# Altium project 报告.PrjPCB
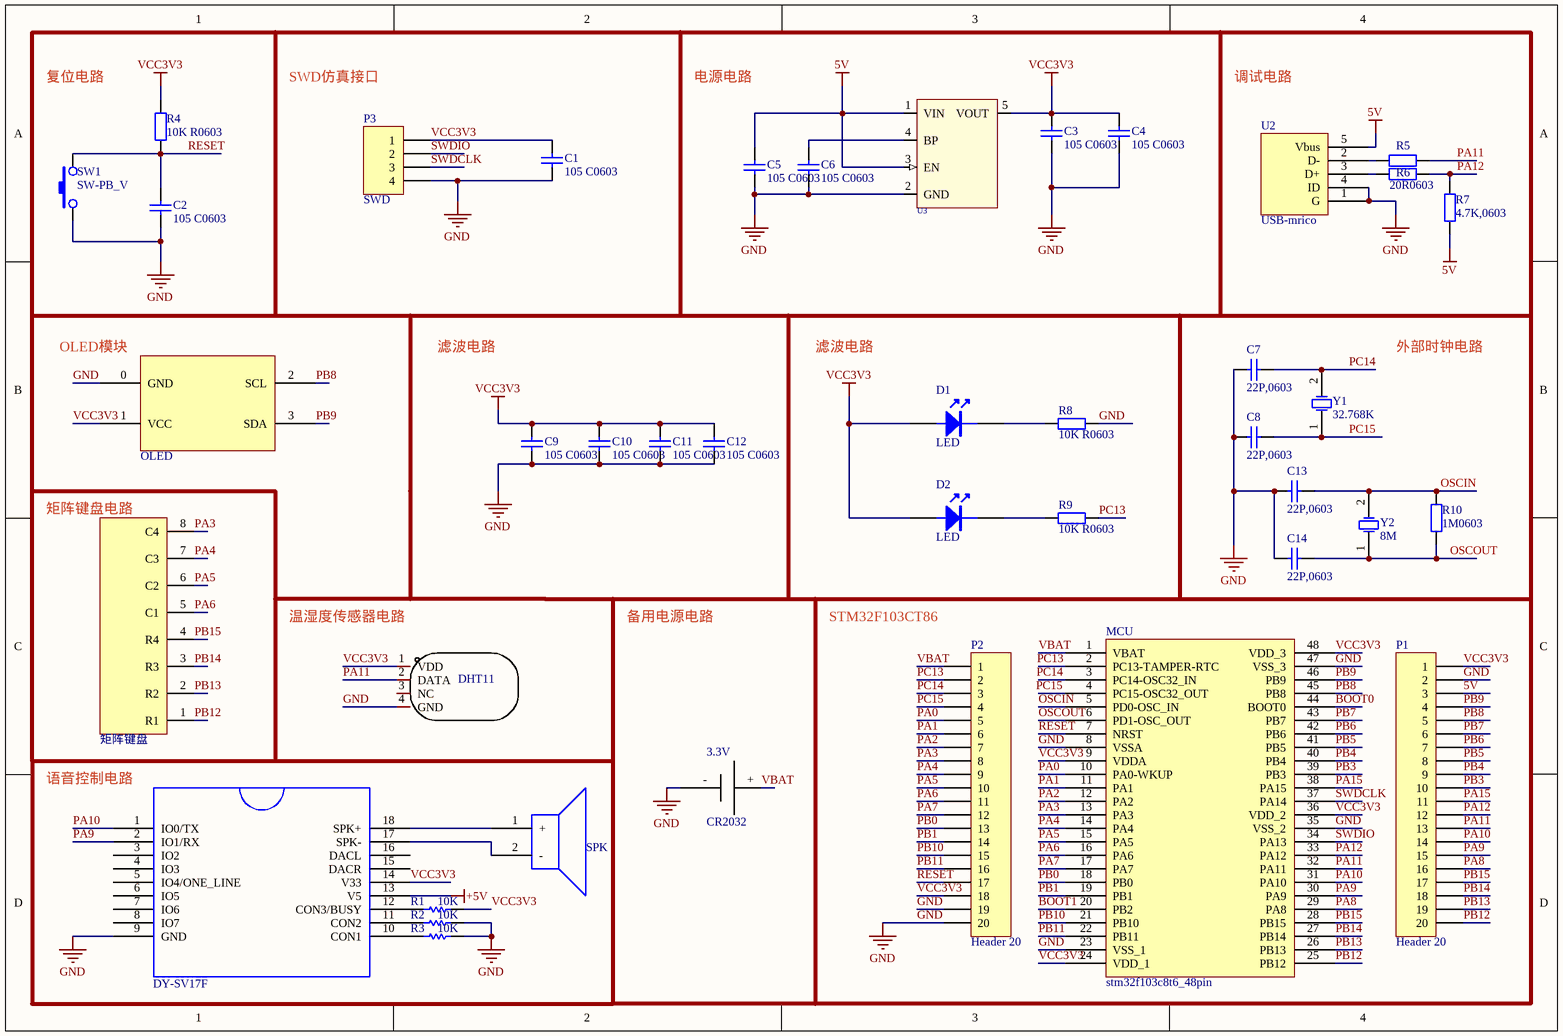
[diagram p0: 原理图.SchDoc]
1 sheet, 41 parts. Net scope: global (net labels, ports and power ports of the same name join across sheets).

## Sheet 原理图.SchDoc
size A4

### Parts
1  SPK
3.3V  CR2032
*  矩阵键盘
?  DY-SV17F
C1  105 C0603  [C 0603]
C2  105 C0603  [C 0603]
C3  105 C0603  [C 0603]
C4  105 C0603  [C 0603]
C5  105 C0603  [C 0603]
C6  105 C0603  [C 0603]
C7  22P,0603  [C 0603]
C8  22P,0603  [C 0603]
C9  105 C0603  [C 0603]
C10  105 C0603  [C 0603]
C11  105 C0603  [C 0603]
C12  105 C0603  [C 0603]
C13  22P,0603  [C 0603]
C14  22P,0603  [C 0603]
D1  LED  [LED 0805G]
D2  LED  [LED 0805G]
MCU  stm32f103c8t6_48pin  [TQFP48 7x7_L]
P1  Header 20  [HDR1X20]
P2  Header 20  [HDR1X20]
P3  SWD  [HDR-1X4_H]
R1  R1  value 10K  [AXIAL-0.3]
R2  R2  value 10K  [AXIAL-0.3]
R3  R3  value 10K  [AXIAL-0.3]
R4  10K R0603  [R 0603]
R5  20R,0603  [R 0603]  (value not drawn)
R6  20R0603  [R 0603]
R7  4.7K,0603  [R 0603]
R8  10K R0603  [R 0603]
R9  10K R0603  [R 0603]
R10  1M0603  [R 0603]
S  OLED  (part D of 4)
SW1  SW-PB_V  [TSW SMD-3*6*2.5]
U1  DHT11  [SENSOR-TH_DHT11]
U2  USB-mrico  [USB-micro_B]
U3  RT9193  [SOT23-5L]  (value not drawn)
Y1  32.768K  [XTAL-49S DIP]
Y2  8M  [XTAL-49S DIP]

### Nets
5V: C5.2 P1.3 R7.1 U2.5(Vbus) U3.1(VIN) U3.3(EN)
+5V: ?.13(V5)
GND: 3.3V.- ?.9(GND) C1.1 C2.1 C3.1 C4.1 C5.1 C6.1 C7.2 C8.2 C9.1 C10.1 C11.1 C12.1 C13.2 C14.2 MCU.8(VSSA) MCU.23(VSS_1) MCU.35(VSS_2) MCU.47(VSS_3) P1.2 P2.19 P2.20 P3.4 R2.2 R3.2 R8.2 S.0(GND) SW1.1 U1.4(GND) U2.1(G) U2.4(ID) U3.2(GND)
VCC3V3: ?.14(V33) C1.2 C3.2 C4.2 C9.2 C10.2 C11.2 C12.2 D1.1 D2.1 MCU.9(VDDA) MCU.24(VDD_1) MCU.36(VDD_2) MCU.48(VDD_3) P1.1 P2.18 P3.1 R1.2 R4.2 S.1(VCC) U1.1(VDD) U3.5(VOUT)
BOOT0: MCU.44(BOOT0)
BOOT1: MCU.20(PB2)
OSCIN: C13.1 MCU.5(PD0-OSC_IN) R10.2 Y2.2(OSC2)
OSCOUT: C14.1 MCU.6(PD1-OSC_OUT) R10.1 Y2.1(OSC1)
PA0: MCU.10(PA0-WKUP) P2.5
PA1: MCU.11(PA1) P2.6
PA2: MCU.12(PA2) P2.7
PA3: *.8(C4) MCU.13(PA3) P2.8
PA4: *.7(C3) MCU.14(PA4) P2.9
PA5: *.6(C2) MCU.15(PA5) P2.10
PA6: *.5(C1) MCU.16(PA6) P2.11
PA7: MCU.17(PA7) P2.12
PA8: MCU.29(PA8) P1.16
PA9: ?.2(IO1/RX) MCU.30(PA9) P1.15
PA10: ?.1(IO0/TX) MCU.31(PA10) P1.14
PA11: MCU.32(PA11) P1.13 R5.2 U1.2(DATA)
PA12: MCU.33(PA12) P1.12 R6.2 R7.2
PA15: MCU.38(PA15) P1.11
PB0: MCU.18(PB0) P2.13
PB1: MCU.19(PB1) P2.14
PB3: MCU.39(PB3) P1.10
PB4: MCU.40(PB4) P1.9
PB5: MCU.41(PB5) P1.8
PB6: MCU.42(PB6) P1.7
PB7: MCU.43(PB7) P1.6
PB8: MCU.45(PB8) P1.5 S.2(SCL)
PB9: MCU.46(PB9) P1.4 S.3(SDA)
PB10: MCU.21(PB10) P2.15
PB11: MCU.22(PB11) P2.16
PB12: *.1(R1) MCU.25(PB12) P1.20
PB13: *.2(R2) MCU.26(PB13) P1.19
PB14: *.3(R3) MCU.27(PB14) P1.18
PB15: *.4(R4) MCU.28(PB15) P1.17
PC13: MCU.2(PC13-TAMPER-RTC) P2.2 R9.2
PC14: C7.1 MCU.3(PC14-OSC32_IN) P2.3 Y1.2(OSC2)
PC15: C8.1 MCU.4(PC15-OSC32_OUT) P2.4 Y1.1(OSC1)
RESET: C2.2 MCU.7(NRST) P2.17 R4.1 SW1.2
SWDCLK: MCU.37(PA14) P3.3
SWDIO: MCU.34(PA13) P3.2
VBAT: 3.3V.+ MCU.1(VBAT) P2.1
Net1_1: 1.1(+) ?.18(SPK+)
Net1_2: 1.2(-) ?.17(SPK-)
Net?_10: ?.10(CON1) R3.1
Net?_11: ?.11(CON2) R2.1
Net?_12: ?.12(CON3/BUSY) R1.1
NetC6_2: C6.2 U3.4(BP)
NetD1_2: D1.2 R8.1
NetD2_2: D2.2 R9.1
NetR5_1: R5.1 U2.2(D-)
NetR6_1: R6.1 U2.3(D+)

Not connected (* = marked no-connect by the designer): ? 3(IO2) 4(IO3) 5(IO4/ONE_LINE) 6(IO5) 7(IO6) 8(IO7) 15(DACR) 16(DACL); U1 3(NC)

### Notes on the sheet
- 复位电路
- SWD仿真接口
- 电源电路
- 调试电路
- (near S) OLED模块
- 滤波电路
- 外部时钟电路
- 矩阵键盘电路
- 温湿度传感器电路
- 备用电源电路
- STM32F103CT86
- 语音控制电路

### Library data of the parts
C1-C6 C9-C12 = Cap: Value: 104; Published: 8-Jun-2000; LatestRevisionDate: 17-Jul-2002; LatestRevisionNote: Re-released for DXP Platform.; Publisher: Altium Limited
C7 C8 C13 C14 = Cap: Capacitor; Value: 104; Published: 8-Jun-2000; LatestRevisionDate: 17-Jul-2002; LatestRevisionNote: Re-released for DXP Platform.; Publisher: Altium Limited
P1 P2 = Header 20: Header, 20-Pin; LatestRevisionDate: 17-Jul-2002; LatestRevisionNote: Re-released for DXP Platform.; Publisher: Altium Limited
P3 = Header 4: Header, 4-Pin; LatestRevisionDate: 17-Jul-2002; LatestRevisionNote: Re-released for DXP Platform.; Publisher: Altium Limited
R1-R3 = Res1: Resistor; Published: 8-Jun-2000; LatestRevisionDate: 17-Jul-2002; LatestRevisionNote: Re-released for DXP Platform.; PackageReference: AXIAL-0.3; Publisher: Altium Limited; PackageDescription: Axial Device, Thru-Hole; 2 Leads; 0.3 in Pin Spacing
R4 R8 R9 = Res2: Published: 8-Jun-2000; LatestRevisionDate: 17-Jul-2002; LatestRevisionNote: Re-released for DXP Platform.; Publisher: Altium Limited
R5-R7 R10 = Res2: Resistor; Published: 8-Jun-2000; LatestRevisionDate: 17-Jul-2002; LatestRevisionNote: Re-released for DXP Platform.; Publisher: Altium Limited
U1 = DHT11: Manufacturer: 广州奥松; Add into BOM: yes; Name: DHT11; Symbol: DHT11; Device: DHT11; LCSC Part Name: DHT11  电容式传感器; Supplier Part: C117051; Manufacturer Part: DHT11; Supplier Footprint: SIP-4; JLCPCB Part Class: Extended Part; Datasheet: https://atta.szlcsc.com/upload/public/pdf/source/20170703/1499081238365.pdf; Supplier: LCSC; Convert to PCB: yes
U2 = usb-STM
U3 = RT9193X_5P: ICA_MFR_NAME: RICHTEK; ICA_PARTNUM: $$2191094$$RT9193-15CU5; Part Number: TMP-13
Y1 Y2 = XTAL: Crystal Oscillator; Published: 8-Jun-2000; LatestRevisionDate: 17-Jul-2002; LatestRevisionNote: Re-released for DXP Platform.; Publisher: Altium Limited